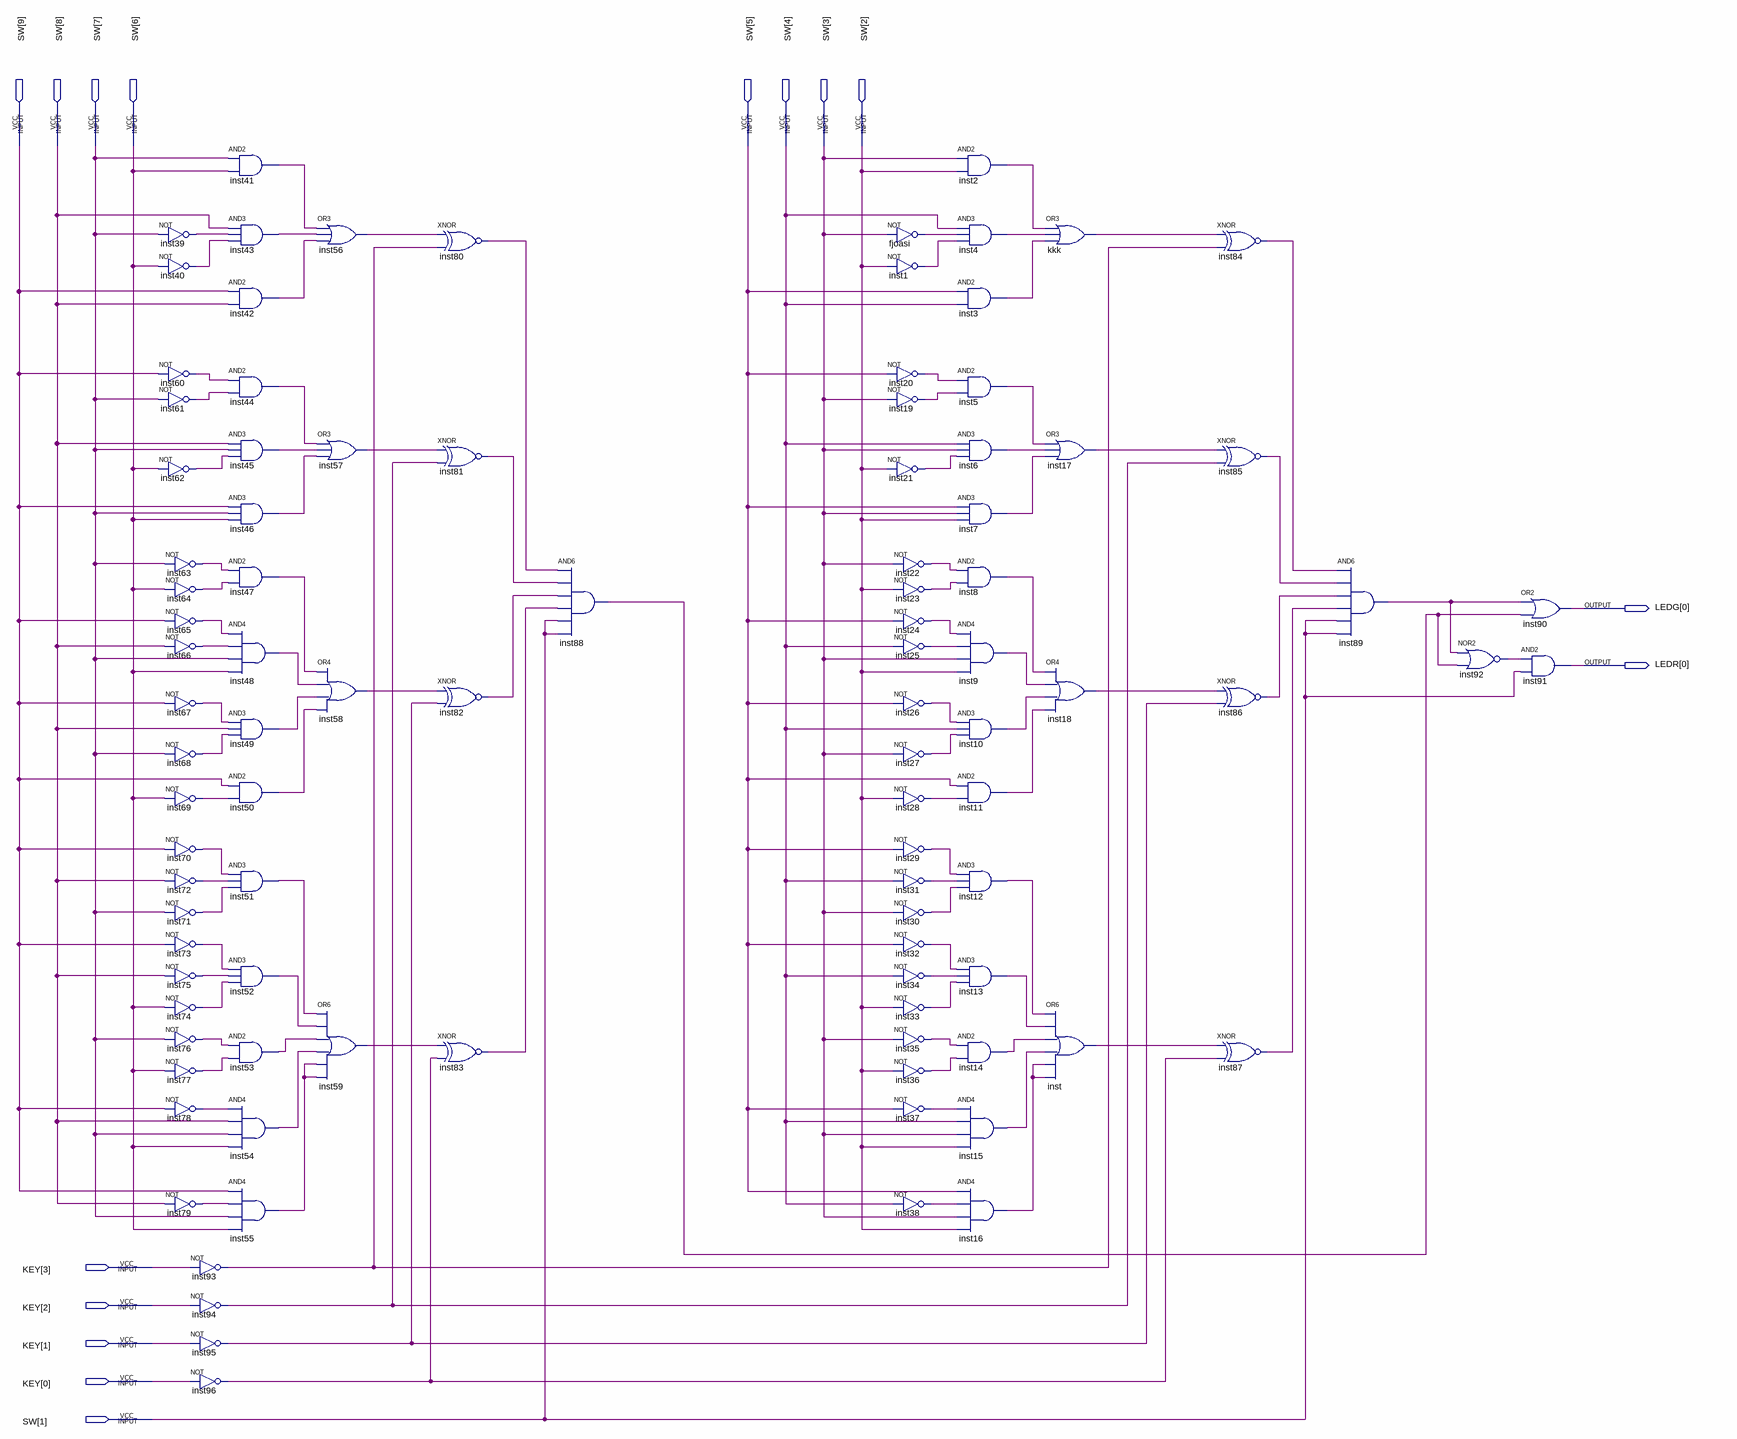
[diagram p0: schematic sheet]
// Quartus schematic Sea_Battle.bdf as structural Verilog: 99 symbols, 15 pins
module Sea_Battle (
  input  [9:1] SW,
  input  [3:0] KEY,
  output [0:0] LEDG,
  output [0:0] LEDR
);

  wire fjoasi_out, inst1_out, inst2_out, inst3_out, inst4_out, inst5_out, inst6_out, inst7_out, inst8_out,
       inst9_out, inst10_out, inst11_out, inst12_out, inst13_out, inst14_out, inst15_out, inst16_out,
       inst17_out, inst18_out, inst19_out, inst20_out, inst21_out, inst22_out, inst23_out, inst24_out,
       inst25_out, inst26_out, inst27_out, inst28_out, inst29_out, inst30_out, inst31_out, inst32_out,
       inst33_out, inst34_out, inst35_out, inst36_out, inst37_out, inst38_out, inst39_out, inst40_out,
       inst41_out, inst42_out, inst43_out, inst44_out, inst45_out, inst46_out, inst47_out, inst48_out,
       inst49_out, inst50_out, inst51_out, inst52_out, inst53_out, inst54_out, inst55_out, inst56_out,
       inst57_out, inst58_out, inst59_out, inst60_out, inst61_out, inst62_out, inst63_out, inst64_out,
       inst65_out, inst66_out, inst67_out, inst68_out, inst69_out, inst70_out, inst71_out, inst72_out,
       inst73_out, inst74_out, inst75_out, inst76_out, inst77_out, inst78_out, inst79_out, inst80_out,
       inst81_out, inst82_out, inst83_out, inst84_out, inst85_out, inst86_out, inst87_out, inst88_out,
       inst89_out, inst92_out, inst93_out, inst94_out, inst95_out, inst96_out, inst_out, kkk_out;

  not inst39 (inst39_out, SW[7]);
  not inst40 (inst40_out, SW[6]);
  not inst60 (inst60_out, SW[9]);
  not inst61 (inst61_out, SW[7]);
  not inst62 (inst62_out, SW[6]);
  not inst63 (inst63_out, SW[7]);
  not inst64 (inst64_out, SW[6]);
  not inst65 (inst65_out, SW[9]);
  not inst66 (inst66_out, SW[8]);
  not inst67 (inst67_out, SW[9]);
  not inst68 (inst68_out, SW[7]);
  not inst69 (inst69_out, SW[6]);
  not inst70 (inst70_out, SW[9]);
  not inst72 (inst72_out, SW[8]);
  not inst71 (inst71_out, SW[7]);
  not inst73 (inst73_out, SW[9]);
  not inst75 (inst75_out, SW[8]);
  not inst74 (inst74_out, SW[6]);
  not inst76 (inst76_out, SW[7]);
  not inst77 (inst77_out, SW[6]);
  not inst78 (inst78_out, SW[9]);
  not inst79 (inst79_out, SW[8]);
  not inst93 (inst93_out, KEY[3]);
  not inst94 (inst94_out, KEY[2]);
  not inst95 (inst95_out, KEY[1]);
  not inst96 (inst96_out, KEY[0]);
  and inst41 (inst41_out, SW[7], SW[6]);
  and inst43 (inst43_out, SW[8], inst39_out, inst40_out);
  and inst42 (inst42_out, SW[9], SW[8]);
  and inst44 (inst44_out, inst60_out, inst61_out);
  and inst45 (inst45_out, SW[8], SW[7], inst62_out);
  and inst46 (inst46_out, SW[9], SW[7], SW[6]);
  and inst47 (inst47_out, inst63_out, inst64_out);
  and inst48 (inst48_out, inst65_out, inst66_out, SW[7], SW[6]);
  and inst49 (inst49_out, inst67_out, SW[8], inst68_out);
  and inst50 (inst50_out, SW[9], inst69_out);
  and inst51 (inst51_out, inst70_out, inst72_out, inst71_out);
  and inst52 (inst52_out, inst73_out, inst75_out, inst74_out);
  and inst53 (inst53_out, inst76_out, inst77_out);
  and inst54 (inst54_out, inst78_out, SW[8], SW[7], SW[6]);
  and inst55 (inst55_out, SW[9], inst79_out, SW[7], SW[6]);
  or inst56 (inst56_out, inst41_out, inst43_out, inst42_out);
  or inst57 (inst57_out, inst44_out, inst45_out, inst46_out);
  or inst58 (inst58_out, inst47_out, inst48_out, inst49_out, inst50_out);
  or inst59 (inst59_out, inst51_out, inst52_out, inst53_out, inst54_out, inst55_out, inst55_out);
  xnor inst80 (inst80_out, inst56_out, inst93_out);
  xnor inst81 (inst81_out, inst57_out, inst94_out);
  xnor inst82 (inst82_out, inst58_out, inst95_out);
  xnor inst83 (inst83_out, inst59_out, inst96_out);
  and inst88 (inst88_out, inst80_out, inst81_out, inst82_out, inst83_out, SW[1], SW[1]);
  not fjoasi (fjoasi_out, SW[3]);
  not inst1 (inst1_out, SW[2]);
  not inst20 (inst20_out, SW[5]);
  not inst19 (inst19_out, SW[3]);
  not inst21 (inst21_out, SW[2]);
  not inst22 (inst22_out, SW[3]);
  not inst23 (inst23_out, SW[2]);
  not inst24 (inst24_out, SW[5]);
  not inst25 (inst25_out, SW[4]);
  not inst26 (inst26_out, SW[5]);
  not inst27 (inst27_out, SW[3]);
  not inst28 (inst28_out, SW[2]);
  not inst29 (inst29_out, SW[5]);
  not inst31 (inst31_out, SW[4]);
  not inst30 (inst30_out, SW[3]);
  not inst32 (inst32_out, SW[5]);
  not inst34 (inst34_out, SW[4]);
  not inst33 (inst33_out, SW[2]);
  not inst35 (inst35_out, SW[3]);
  not inst36 (inst36_out, SW[2]);
  not inst37 (inst37_out, SW[5]);
  not inst38 (inst38_out, SW[4]);
  and inst2 (inst2_out, SW[3], SW[2]);
  and inst4 (inst4_out, SW[4], fjoasi_out, inst1_out);
  and inst3 (inst3_out, SW[5], SW[4]);
  and inst5 (inst5_out, inst20_out, inst19_out);
  and inst6 (inst6_out, SW[4], SW[3], inst21_out);
  and inst7 (inst7_out, SW[5], SW[3], SW[2]);
  and inst8 (inst8_out, inst22_out, inst23_out);
  and inst9 (inst9_out, inst24_out, inst25_out, SW[3], SW[2]);
  and inst10 (inst10_out, inst26_out, SW[4], inst27_out);
  and inst11 (inst11_out, SW[5], inst28_out);
  and inst12 (inst12_out, inst29_out, inst31_out, inst30_out);
  and inst13 (inst13_out, inst32_out, inst34_out, inst33_out);
  and inst14 (inst14_out, inst35_out, inst36_out);
  and inst15 (inst15_out, inst37_out, SW[4], SW[3], SW[2]);
  and inst16 (inst16_out, SW[5], inst38_out, SW[3], SW[2]);
  or kkk (kkk_out, inst2_out, inst4_out, inst3_out);
  or inst17 (inst17_out, inst5_out, inst6_out, inst7_out);
  or inst18 (inst18_out, inst8_out, inst9_out, inst10_out, inst11_out);
  or inst (inst_out, inst12_out, inst13_out, inst14_out, inst15_out, inst16_out, inst16_out);
  xnor inst84 (inst84_out, kkk_out, inst93_out);
  xnor inst85 (inst85_out, inst17_out, inst94_out);
  xnor inst86 (inst86_out, inst18_out, inst95_out);
  xnor inst87 (inst87_out, inst_out, inst96_out);
  and inst89 (inst89_out, inst84_out, inst85_out, inst86_out, inst87_out, SW[1], SW[1]);
  nor inst92 (inst92_out, inst89_out, inst88_out);
  or inst90 (LEDG[0], inst89_out, inst88_out);
  and inst91 (LEDR[0], inst92_out, SW[1]);
endmodule
